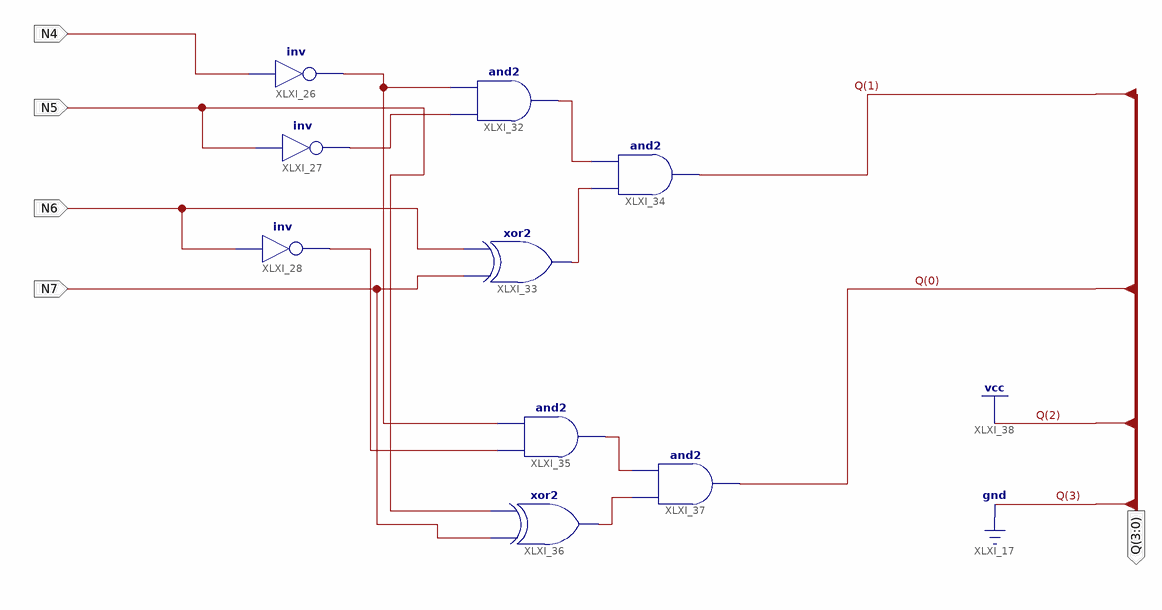
[diagram p0: schematic sheet 1]
// Xilinx ISE schematic NUM47.sch (spartan6) as structural Verilog: 9 symbols, 5 ports
module NUM47 (
  input  N6,
  input  N7,
  input  N4,
  input  N5,
  output [3:0] Q
);

  wire XLXN_81, XLXN_82, XLXN_83, XLXN_84, XLXN_86, XLXN_88, XLXN_89;

  not XLXI_27 (XLXN_82, N5);
  not XLXI_28 (XLXN_86, N6);
  not XLXI_26 (XLXN_81, N4);
  and XLXI_32 (XLXN_83, XLXN_82, XLXN_81);
  xor XLXI_33 (XLXN_84, N7, N6);
  and XLXI_34 (Q[1], XLXN_84, XLXN_83);
  and XLXI_35 (XLXN_88, XLXN_86, XLXN_81);
  xor XLXI_36 (XLXN_89, N7, N5);
  and XLXI_37 (Q[0], XLXN_89, XLXN_88);

  assign Q[3:2] = 2'b01;
endmodule
